# Altium schematic sheet FCC_Connectors.SchDoc
size A4; SheetNumber: 7; SheetTotal: 8
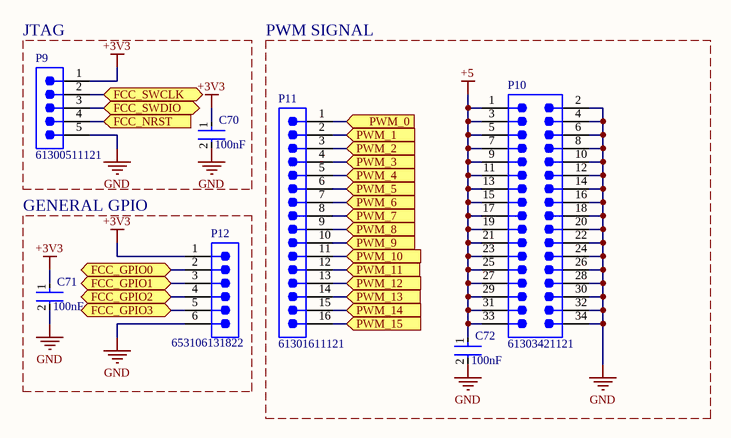
[diagram p0: FCC_Connectors.SchDoc]

## Parts
C70  100nF  [FP-CGA3E-0_3-0_1-IPC_A]
C71  100nF  [FP-CGA3E-0_3-0_1-IPC_A]
C72  100nF  [FP-CGA3E-0_3-0_1-IPC_A]
P9  61300511121  [61300511121]
P10  61303421121  [61303421121]
P11  61301611121  [61301611121]
P12  653106131822  [653106131822]

## Blocks framed on the sheet
JTAG: C70 P9
PWM SIGNAL: C72 P10 P11
GENERAL GPIO: C71 P12

## Ports
FCC_GPIO0 (bidir, see FCC_MCU[2A]), FCC_GPIO1 (bidir, see FCC_MCU[2A]), FCC_GPIO2 (bidir, see FCC_MCU[2A]), FCC_GPIO3 (bidir, see FCC_MCU[2A]), FCC_NRST (in, see FCC_MCU[3C], FCC_MCU[4A]), FCC_SWCLK (bidir, see FCC_MCU[1B]), FCC_SWDIO (bidir, see FCC_MCU[1B]), PWM_0 (in, see FCC_Peripherals[2B]), PWM_1 (in, see FCC_Peripherals[2B]), PWM_2 (in, see FCC_Peripherals[2B]), PWM_3 (in, see FCC_Peripherals[2B]), PWM_4 (in, see FCC_Peripherals[2B]), PWM_5 (in, see FCC_Peripherals[2B]), PWM_6 (in, see FCC_Peripherals[2C]), PWM_7 (in, see FCC_Peripherals[2C]), PWM_8 (in, see FCC_Peripherals[2C]), PWM_9 (in, see FCC_Peripherals[2C]), PWM_10 (in, see FCC_Peripherals[2C]), PWM_11 (in, see FCC_Peripherals[2C]), PWM_12 (in, see FCC_Peripherals[2C]), PWM_13 (in, see FCC_Peripherals[2C]), PWM_14 (in, see FCC_Peripherals[2C]), PWM_15 (in, see FCC_Peripherals[2C])

## Nets
+3V3: C70.1 C71.1 P9.1 P12.1
+5: C72.1 P10.1 P10.3 P10.5 P10.7 P10.9 P10.11 P10.13 P10.15 P10.17 P10.19 P10.21 P10.23 P10.25 P10.27 P10.29 P10.31 P10.33
GND: C70.2 C71.2 C72.2 P9.5 P10.2 P10.4 P10.6 P10.8 P10.10 P10.12 P10.14 P10.16 P10.18 P10.20 P10.22 P10.24 P10.26 P10.28 P10.30 P10.32 P10.34 P12.6
FCC_GPIO0: P12.2 ; port FCC_GPIO0
FCC_GPIO1: P12.3 ; port FCC_GPIO1
FCC_GPIO2: P12.4 ; port FCC_GPIO2
FCC_GPIO3: P12.5 ; port FCC_GPIO3
FCC_NRST: P9.4 ; port FCC_NRST
FCC_SWCLK: P9.2 ; port FCC_SWCLK
FCC_SWDIO: P9.3 ; port FCC_SWDIO
PWM_0: P11.1 ; port PWM_0
PWM_1: P11.2 ; port PWM_1
PWM_2: P11.3 ; port PWM_2
PWM_3: P11.4 ; port PWM_3
PWM_4: P11.5 ; port PWM_4
PWM_5: P11.6 ; port PWM_5
PWM_6: P11.7 ; port PWM_6
PWM_7: P11.8 ; port PWM_7
PWM_8: P11.9 ; port PWM_8
PWM_9: P11.10 ; port PWM_9
PWM_10: P11.11 ; port PWM_10
PWM_11: P11.12 ; port PWM_11
PWM_12: P11.13 ; port PWM_12
PWM_13: P11.14 ; port PWM_13
PWM_14: P11.15 ; port PWM_14
PWM_15: P11.16 ; port PWM_15

## Library data of the parts
C70-C72 = CMP-2000-07546-2: Cap Ceramic 100nF 50V X7R 10% Pad SMD 0603 +125°C Automotive T/R; Weight: 7.1E-05oz; Composition: Ceramic; Max Operating Temperature: 125°C; Termination: SMD/SMT; Dielectric: X7R; Length: 1.6mm; Package Quantity: 1; REACH SVHC: No SVHC; Lead Free: Lead Free; Case Code (Metric): 1608; Min Operating Temperature: -55°C; Packaging: Tape and Reel; Tolerance: 10%; Voltage Rating: 50V; Case Code (Imperial): 0603; Capacitance: 100nF; Case/Package: 0603; Voltage Rating (DC): 50V; Depth: 0.8mm; Radiation Hardening: No; Ratings: AEC-Q200; Mount: Surface Mount; Voltage: 50V; Thickness: 0.035inch; Width: 0.8mm; Height: 0.8mm
P9 = CMP-1502-01068-3: NexarPartId: 32855526; Connector Type: Male Pin; Gender: Male; Contact Resistance: 20mΩ; Pitch: 2.54mm; Operating Supply Voltage: 250V; Current Rating: 3A; Number of Contacts: 5; Lead Free: Lead Free; Color: Black; Packaging: Bulk; Lead Pitch: 2.54mm; Contact Material: Copper; Min Operating Temperature: -40°C; Contact Mating Length: 5.9944mm; Voltage Rating: 250V; Number of Pins: 5; Number of Positions: 5; Height: 8.89mm; Orientation: Vertical; REACH SVHC: Unknown; RoHS: Compliant; Contact Plating: Gold; Max Operating Temperature: 105°C; Mount: Through Hole; Number of Rows: 1; Termination: Solder
P10 = CMP-1502-01127-3: NexarPartId: 32855572; Operating Supply Voltage: 250V; Number of Positions: 34; Pitch: 2.54mm; Contact Resistance: 20mΩ; Connector Type: Male Pin; Gender: Male; Current Rating: 3A; Termination: Solder; Packaging: Bulk; Number of Rows: 2; Contact Plating: Gold; Contact Material: Copper; Orientation: Vertical; Number of Contacts: 34; REACH SVHC: Unknown; RoHS: Compliant; Lead Pitch: 2.54mm; Contact Mating Length: 5.9944mm; Color: Black; Row Spacing: 2.54mm; Mount: Through Hole; Number of Pins: 34
P11 = CMP-1502-01095-4: NexarPartId: 32855548; Voltage Rating: 250V; Connector Type: Male Pin; Current Rating: 3A; Contact Resistance: 20mΩ; Number of Contacts: 16; Gender: Male; Pitch: 2.54mm; Min Operating Temperature: -40°C; Termination: Solder; Height: 8.89mm; Contact Plating: Gold; Packaging: Bulk; Contact Material: Copper; Mount: Through Hole; Number of Rows: 1; Contact Mating Length: 5.9944mm; Operating Supply Voltage: 250V; RoHS: Compliant; Max Operating Temperature: 105°C; Lead Pitch: 2.54mm; Color: Black; Number of Pins: 16; Number of Positions: 16; REACH SVHC: Unknown; Orientation: Vertical
P12 = CMP-1502-00775-2: NexarPartId: 116856464; Insulation Resistance: 100MΩ; Current Rating: 1A; Gender: Male; Pitch: 1.25mm; Min Operating Temperature: -40°C; Packaging: Tape and Reel; Length: 12.25mm; Contact Plating: Tin; Max Operating Temperature: 85°C; Number of Pins: 6; RoHS: Compliant